# EAGLE design de0_expansion (EAGLE 6.4)
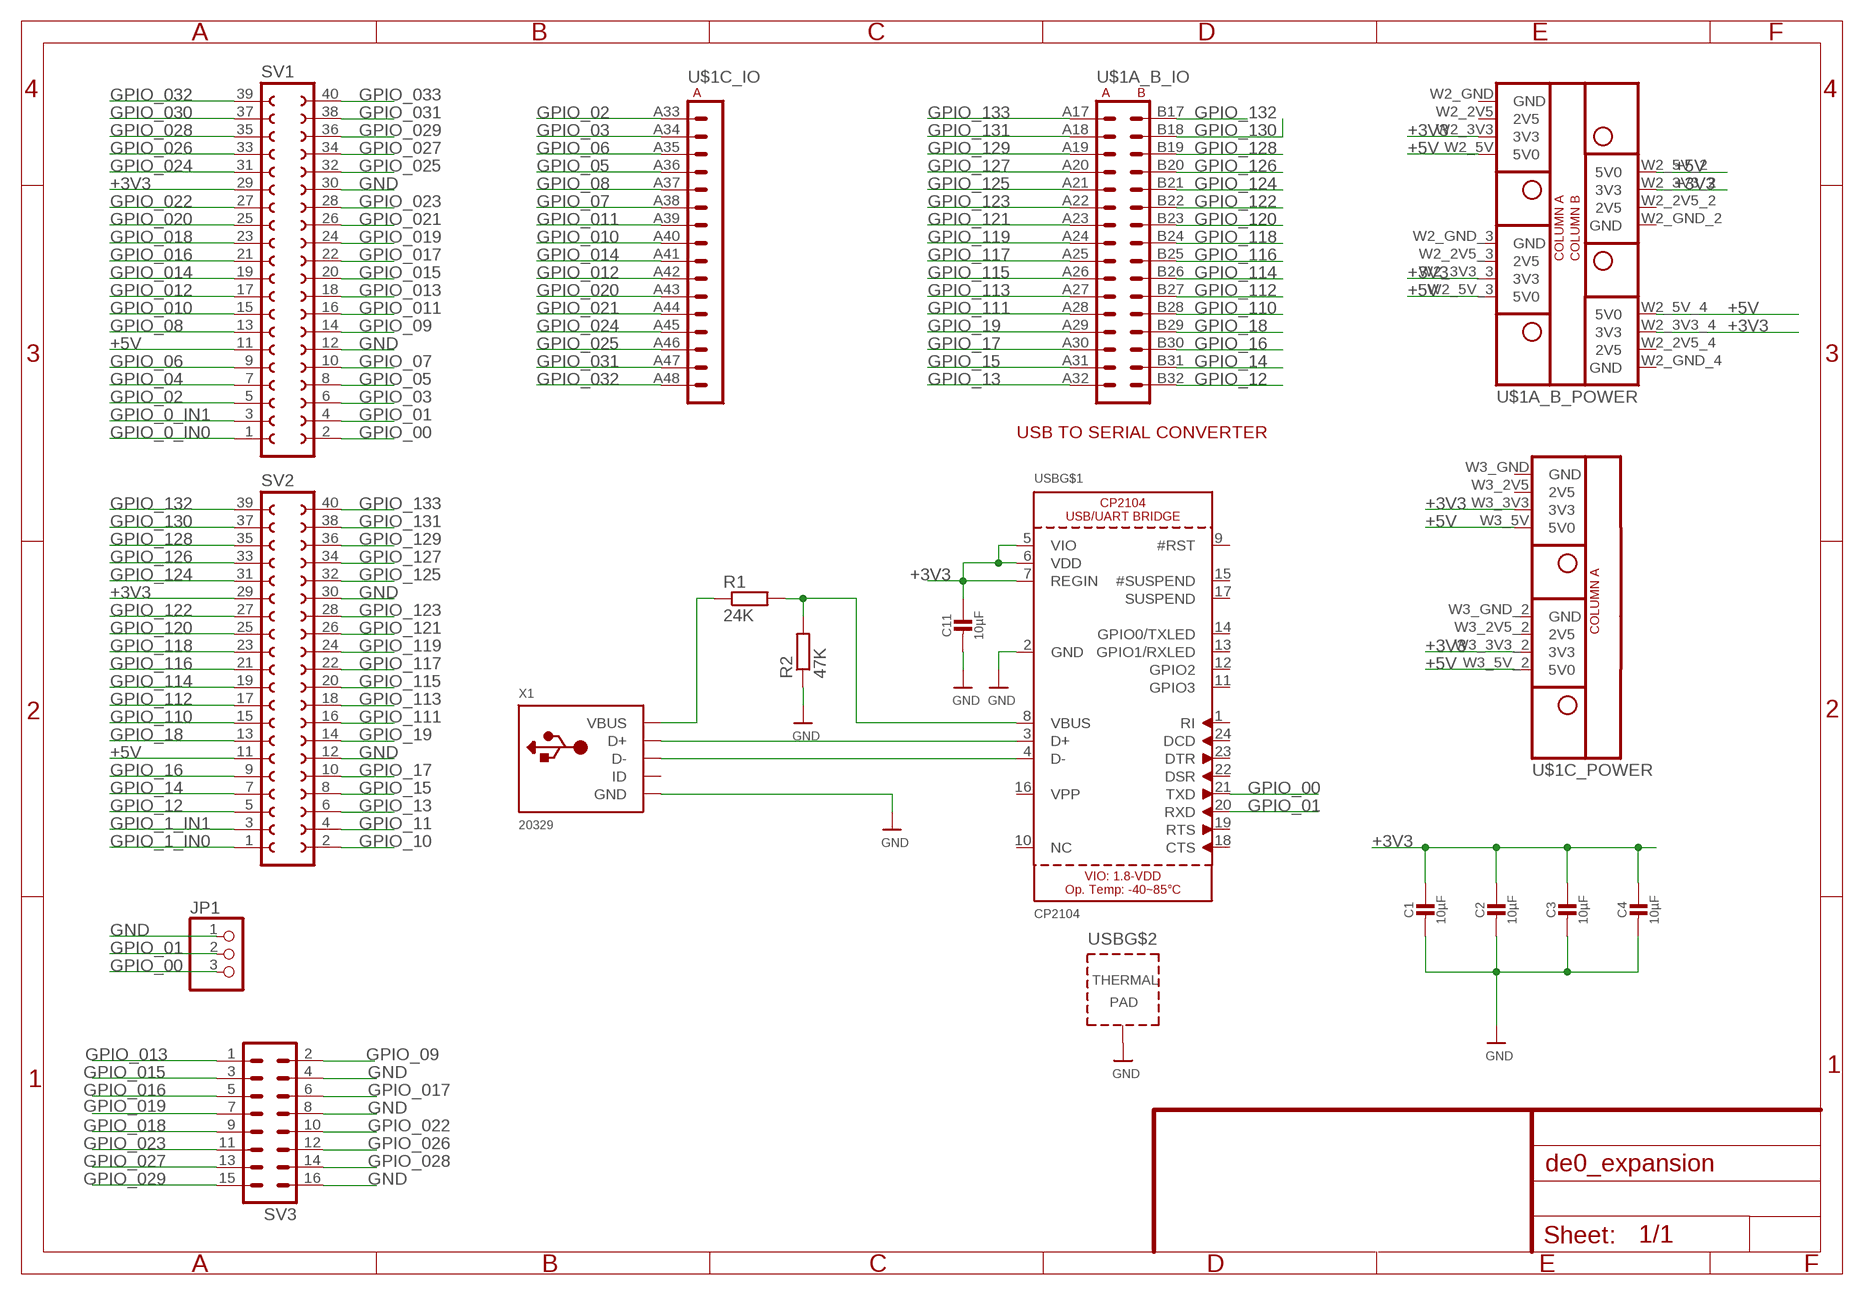
[diagram p0: schematic, sheet 1]

## Parts
C1  10µF  CAP_CERAMIC0805-NOOUTLINE  [0805-NO]
C2  10µF  CAP_CERAMIC0805-NOOUTLINE  [0805-NO]
C3  10µF  CAP_CERAMIC0805-NOOUTLINE  [0805-NO]
C4  10µF  CAP_CERAMIC0805-NOOUTLINE  [0805-NO]
C11  10µF  CAP_CERAMIC0805-NOOUTLINE  [0805-NO]
JP1  PINHD-1X3  [1X03]
R1  24K  R-EU_R0805W  [R0805W]
R2  47K  R-EU_R0805W  [R0805W]
SV1  FE20-2  [FE20-2]
SV2  FE20-2  [FE20-2]
SV3  ML16  [ML16]
U$1  MEGAWING_FULL_P1MEGAWING_P1  [MEGAWING_FULL_NOHOLES_P1]
USB  CP2104  [QFN24_4MM_SMSC]
X1  20329  USBMINIBLARGE  [USB-MINIB_LARGER]

## Nets
+3V3: C1.1 C2.1 C3.1 C4.1 C11.1 SV1.29 SV2.29 U$1.W2_3V3(A_B_POWER:3V3) U$1.W2_3V3_2(A_B_POWER:3V3) U$1.W2_3V3_3(A_B_POWER:3V3) U$1.W2_3V3_4(A_B_POWER:3V3) U$1.W3_3V3(C_POWER:3V3) U$1.W3_3V3_2(C_POWER:3V3) USB.5(VIO) USB.6(VDD) USB.7(REGIN)
+5V: SV1.11 SV2.11 U$1.W2_5V(A_B_POWER:5V0) U$1.W2_5V_2(A_B_POWER:5V0) U$1.W2_5V_3(A_B_POWER:5V0) U$1.W2_5V_4(A_B_POWER:5V0) U$1.W3_5V(C_POWER:5V0) U$1.W3_5V_2(C_POWER:5V0)
GND: C1.2 C2.2 C3.2 C4.2 C11.2 JP1.1 R2.1 SV1.12 SV1.30 SV2.12 SV2.30 SV3.4 SV3.8 SV3.16 USB.2(GND) USB.THERM(TP) X1.GND
GPIO_00: JP1.3 SV1.2 USB.21(TXD)
GPIO_0_IN0: SV1.1
GPIO_0_IN1: SV1.3
GPIO_01: JP1.2 SV1.4 USB.20(RXD)
GPIO_1_IN0: SV2.1
GPIO_1_IN1: SV2.3
GPIO_02: SV1.5 U$1.A33(C_IO:A1)
GPIO_03: SV1.6 U$1.A34(C_IO:A2)
GPIO_04: SV1.7
GPIO_05: SV1.8 U$1.A36(C_IO:A4)
GPIO_06: SV1.9 U$1.A35(C_IO:A3)
GPIO_07: SV1.10 U$1.A38(C_IO:A6)
GPIO_08: SV1.13 U$1.A37(C_IO:A5)
GPIO_09: SV1.14 SV3.2
GPIO_010: SV1.15 U$1.A40(C_IO:A8)
GPIO_10: SV2.2
GPIO_011: SV1.16 U$1.A39(C_IO:A7)
GPIO_11: SV2.4
GPIO_012: SV1.17 U$1.A42(C_IO:A10)
GPIO_12: SV2.5 U$1.B32(A_B_IO:B16)
GPIO_013: SV1.18 SV3.1
GPIO_13: SV2.6 U$1.A32(A_B_IO:A16)
GPIO_014: SV1.19 U$1.A41(C_IO:A9)
GPIO_14: SV2.7 U$1.B31(A_B_IO:B15)
GPIO_015: SV1.20 SV3.3
GPIO_15: SV2.8 U$1.A31(A_B_IO:A15)
GPIO_016: SV1.21 SV3.5
GPIO_16: SV2.9 U$1.B30(A_B_IO:B14)
GPIO_017: SV1.22 SV3.6
GPIO_17: SV2.10 U$1.A30(A_B_IO:A14)
GPIO_018: SV1.23 SV3.9
GPIO_18: SV2.13 U$1.B29(A_B_IO:B13)
GPIO_019: SV1.24 SV3.7
GPIO_19: SV2.14 U$1.A29(A_B_IO:A13)
GPIO_020: SV1.25 U$1.A43(C_IO:A11)
GPIO_021: SV1.26 U$1.A44(C_IO:A12)
GPIO_022: SV1.27 SV3.10
GPIO_023: SV1.28 SV3.11
GPIO_024: SV1.31 U$1.A45(C_IO:A13)
GPIO_025: SV1.32 U$1.A46(C_IO:A14)
GPIO_026: SV1.33 SV3.12
GPIO_027: SV1.34 SV3.13
GPIO_028: SV1.35 SV3.14
GPIO_029: SV1.36 SV3.15
GPIO_030: SV1.37
GPIO_031: SV1.38 U$1.A47(C_IO:A15)
GPIO_032: SV1.39 U$1.A48(C_IO:A16)
GPIO_033: SV1.40
GPIO_110: SV2.15 U$1.B28(A_B_IO:B12)
GPIO_111: SV2.16 U$1.A28(A_B_IO:A12)
GPIO_112: SV2.17 U$1.B27(A_B_IO:B11)
GPIO_113: SV2.18 U$1.A27(A_B_IO:A11)
GPIO_114: SV2.19 U$1.B26(A_B_IO:B10)
GPIO_115: SV2.20 U$1.A26(A_B_IO:A10)
GPIO_116: SV2.21 U$1.B25(A_B_IO:B9)
GPIO_117: SV2.22 U$1.A25(A_B_IO:A9)
GPIO_118: SV2.23 U$1.B24(A_B_IO:B8)
GPIO_119: SV2.24 U$1.A24(A_B_IO:A8)
GPIO_120: SV2.25 U$1.B23(A_B_IO:B7)
GPIO_121: SV2.26 U$1.A23(A_B_IO:A7)
GPIO_122: SV2.27 U$1.B22(A_B_IO:B6)
GPIO_123: SV2.28 U$1.A22(A_B_IO:A6)
GPIO_124: SV2.31 U$1.B21(A_B_IO:B5)
GPIO_125: SV2.32 U$1.A21(A_B_IO:A5)
GPIO_126: SV2.33 U$1.B20(A_B_IO:B4)
GPIO_127: SV2.34 U$1.A20(A_B_IO:A4)
GPIO_128: SV2.35 U$1.B19(A_B_IO:B3)
GPIO_129: SV2.36 U$1.A19(A_B_IO:A3)
GPIO_130: SV2.37 U$1.B18(A_B_IO:B2)
GPIO_131: SV2.38 U$1.A18(A_B_IO:A2)
GPIO_132: SV2.39 U$1.B17(A_B_IO:B1)
GPIO_133: SV2.40 U$1.A17(A_B_IO:A1)
N$1: R1.2 R2.2 USB.8(VBUS)
N$2: USB.3(D+) X1.D+
N$4: R1.1 X1.VBUS
N$6: USB.4(D-) X1.D-
Unconnected: U$1.W2_2V5(A_B_POWER:2V5) U$1.W2_2V5_2(A_B_POWER:2V5) U$1.W2_2V5_3(A_B_POWER:2V5) U$1.W2_2V5_4(A_B_POWER:2V5) U$1.W3_2V5(C_POWER:2V5) U$1.W3_2V5_2(C_POWER:2V5) USB.1(RI) USB.9(#RST) USB.10(NC) USB.11(GPIO3) USB.12(GPIO2) USB.13(GPIO1/RXLED) USB.14(GPIO0/TXLED) USB.15(#SUSPEND) USB.16(VPP) USB.17(SUSPEND) USB.18(CTS) USB.19(RTS) USB.22(DSR) USB.23(DTR) USB.24(DCD) X1.ID

## Notes on the sheet
- USB TO SERIAL CONVERTER

## Power pins joined to a net without a drawn wire
GND: U$1.W2_GND(A_B_POWER:GND) U$1.W2_GND_2(A_B_POWER:GND) U$1.W2_GND_3(A_B_POWER:GND) U$1.W2_GND_4(A_B_POWER:GND) U$1.W3_GND(C_POWER:GND) U$1.W3_GND_2(C_POWER:GND)

## Library data of the parts
C1-C4 C11 = microbuilder:CAP_CERAMIC: Ceramic Capacitors For new designs, use the packages preceded by an '_' character since they are more reliable: The following footprints should be used on most boards: _0402 - Standard footprint for regular board layouts _0603 - Standard footprint for regular board layouts _0805 - Standard footprint for regular board layouts _1206 - Standard footprint for regular board layouts For extremely tight-pitch boards where space is at a premium, the following 'micro-pitch' footprints can be used (smaller pads, no silkscreen outline, etc.): _0402MP - Micro-pitch footprint for very dense/compact boards _0603MP - Micro-pitch footprint for very dense/compact boards _0805MP - Micro-pitch footprint for very dense/compact boards _1206MP - Micro-pitch footprint for very dense/compact boards; PARTNO: CL21F106ZPFNNNE,Samsung,DK,1276-3012-1-ND,CAP CER 10UF 10V Y5V 0805, REF1
JP1 = pinhead:PINHD-1X3: PIN HEADER
R1 R2 = rcl:R-EU_: RESISTOR, European symbol
SV1 SV2 = con-lsta:FE20-2: FEMALE HEADER; OC_FARNELL: unknown; OC_NEWARK: unknown
SV3 = con-ml:ML16: HARTING; PARTNO: PRPC004DAAN-RC
U$1 = Papilio:MEGAWING_FULL_P1
USB = microbuilder:CP2104: CP2104 - USB to UART Bridge VDD Output: 3.45V; PARTNO: CP2104-F03-GM,Silicon Labs,dk,336-2008-5-ND ,IC SGL USB-TO-UART BRIDGE 24QFN, REF106
X1 = microbuilder:USB: USB Connectors USBMINIB - Surface Mount Female Mini-B USB Connector 4UConnector: 06564; PARTNO: 10118193-0001LF,Amphenol,dk,609-4616-1-ND ,USB micro B USB 2.0 Receptacle Connector 5 Position Surface Mount Right Angle Horizontal , REF86

## Board
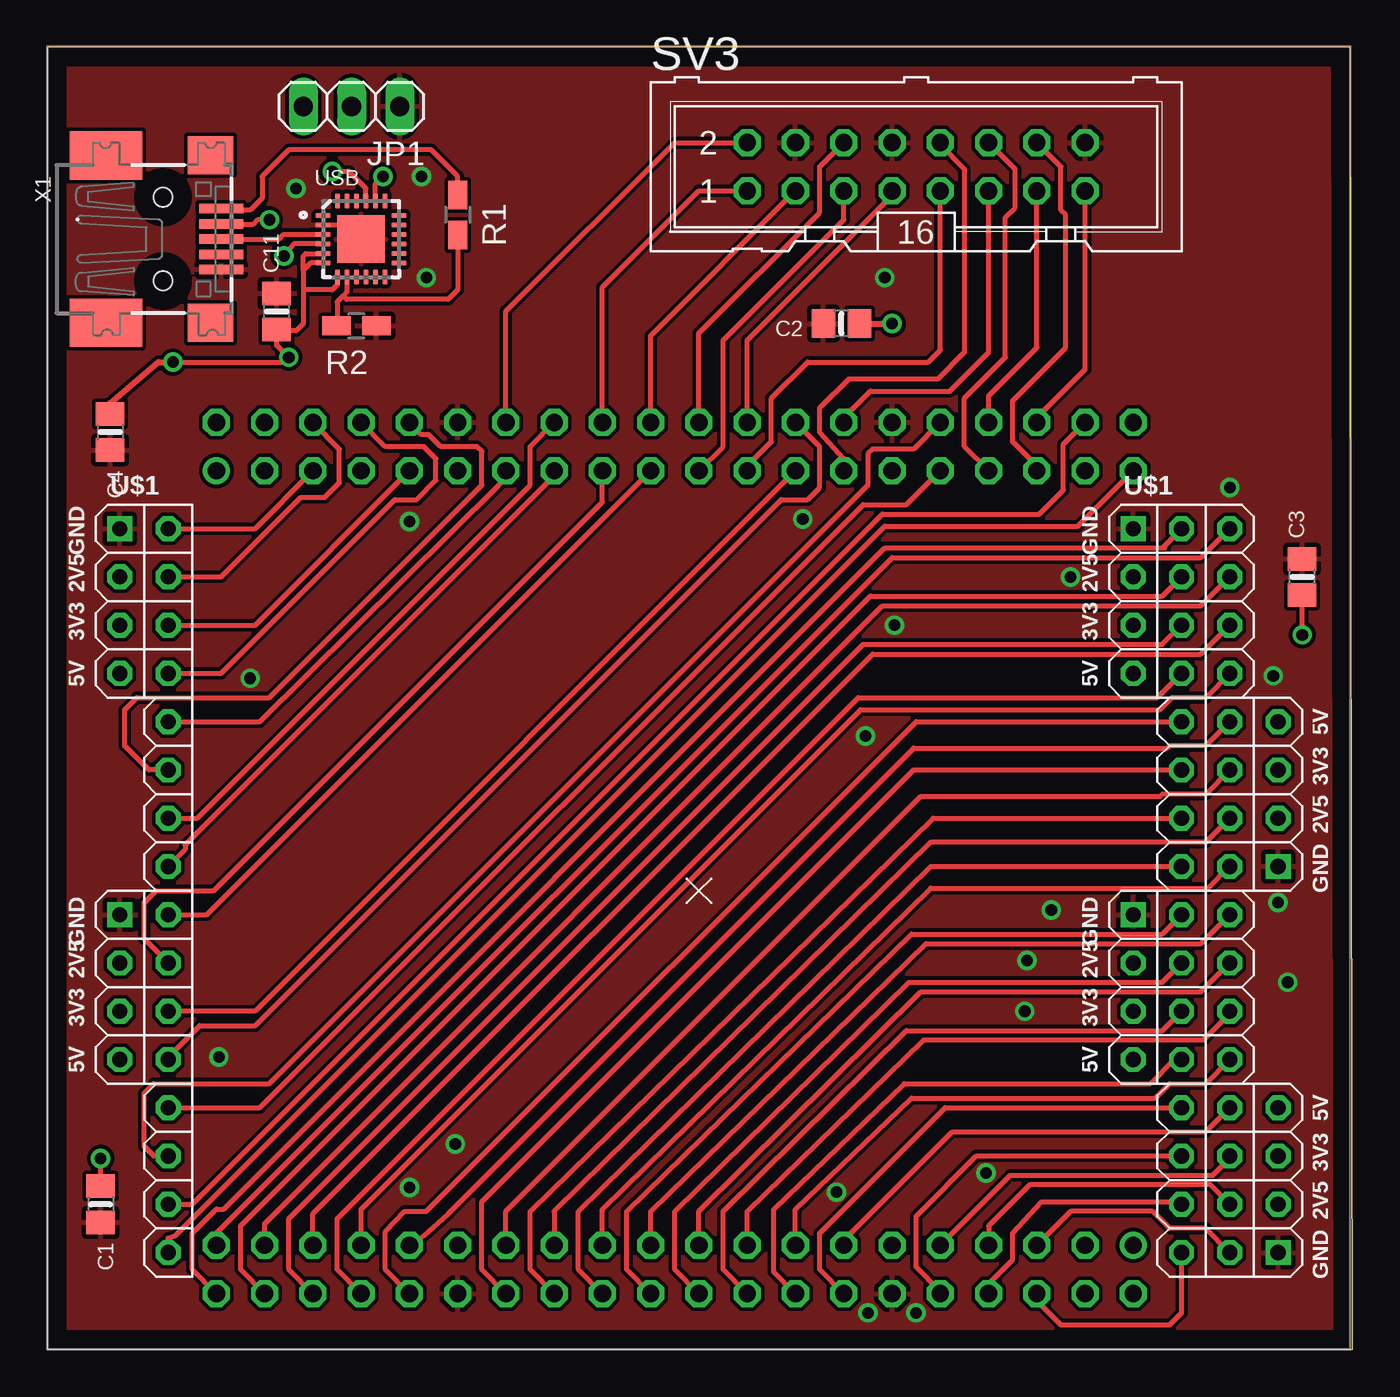
[diagram p1: board, top side]
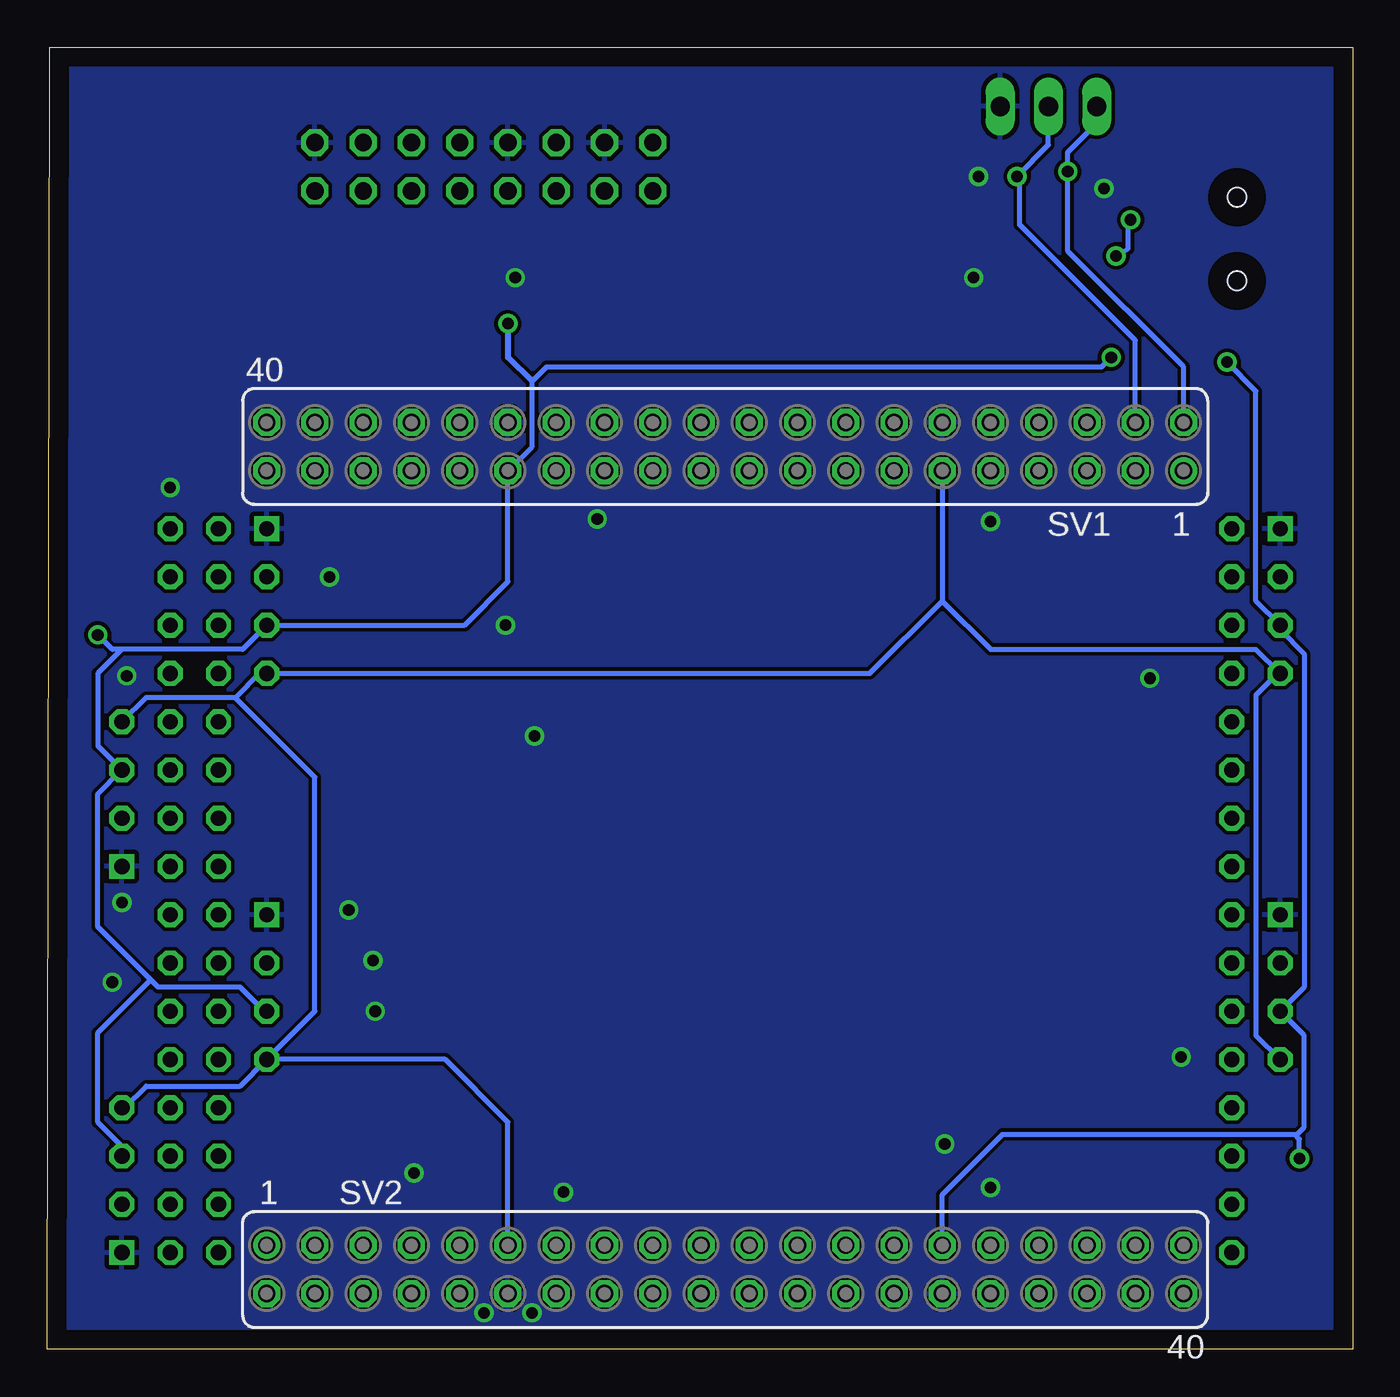
[diagram p2: board, bottom side, seen from below]

Size 68.69 x 68.5 mm. Coordinates in mm from the lower left corner, seen from the top.
Outline: 0,0 68.69,0 68.56,68.5 0,68.5 0,0
Copper layers (1*16): Top 0.035mm / dielectric 1.5mm / Bottom 0.035mm
Design rules "default": minimum track width 10mil, minimum drill 24mil, track to track 8mil, track to pad 8mil, pad to pad 8mil, via to via 8mil, smd to smd 8mil, copper to edge 40mil, drill to drill 8mil, minimum pad ring 10mil, minimum via ring 8mil, stop-mask expansion 4mil, vias tented up to drill 0mil, thermal gap 10mil

### Footprints (pad centres in the part's own frame; a part is rotated, then mirrored left to right if it is on the bottom)
0805-NO = smd 1.24 x 1.5: 1 -0.95,0; 2 0.95,0
1X03 = drill 1.016 long: 1 -2.54,0; 2 0,0; 3 2.54,0
R0805W = smd 1.5 x 1: 1 -1.052,0; 2 1.052,0
FE20-2 = drill 0.914: 1 -24.13,1.27 | drill 0.914 octagon: 2 -24.13,-1.27; 3 -21.59,1.27; 4 -21.59,-1.27; 5 -19.05,1.27; 6 -19.05,-1.27; 7 -16.51,1.27; 8 -16.51,-1.27; 9 -13.97,1.27; 10 -13.97,-1.27; 11 -11.43,1.27; 12 -11.43,-1.27; 13 -8.89,1.27; 14 -8.89,-1.27; 15 -6.35,1.27; 16 -6.35,-1.27; 17 -3.81,1.27; 18 -3.81,-1.27; 19 -1.27,1.27; 20 -1.27,-1.27; 21 1.27,1.27; 22 1.27,-1.27; 23 3.81,1.27; 24 3.81,-1.27; 25 6.35,1.27; 26 6.35,-1.27; 27 8.89,1.27; 28 8.89,-1.27; 29 11.43,1.27; 30 11.43,-1.27; 31 13.97,1.27; 32 13.97,-1.27; 33 16.51,1.27; 34 16.51,-1.27; 35 19.05,1.27; 36 19.05,-1.27; 37 21.59,1.27; 38 21.59,-1.27; 39 24.13,1.27; 40 24.13,-1.27
ML16 = drill 0.914 octagon: 1 -8.89,-1.27; 2 -8.89,1.27; 3 -6.35,-1.27; 4 -6.35,1.27; 5 -3.81,-1.27; 6 -3.81,1.27; 7 -1.27,-1.27; 8 -1.27,1.27; 9 1.27,-1.27; 10 1.27,1.27; 11 3.81,-1.27; 12 3.81,1.27; 13 6.35,-1.27; 14 6.35,1.27; 15 8.89,-1.27; 16 8.89,1.27
MEGAWING_FULL_NOHOLES_P1 = drill 0.8 octagon: A17 59.69,43.18; A18 59.69,40.64; A19 59.69,38.1; A20 59.69,35.56; A21 59.69,33.02; A22 59.69,30.48; A23 59.69,27.94; A24 59.69,25.4; A25 59.69,22.86; A26 59.69,20.32; A27 59.69,17.78; A28 59.69,15.24; A29 59.69,12.7; A30 59.69,10.16; A31 59.69,7.62; A32 59.69,5.08; A33 6.35,43.18; A34 6.35,40.64; A35 6.35,38.1; A36 6.35,35.56; A37 6.35,33.02; A38 6.35,30.48; A39 6.35,27.94; A40 6.35,25.4; A41 6.35,22.86; A42 6.35,20.32; A43 6.35,17.78; A44 6.35,15.24; A45 6.35,12.7; A46 6.35,10.16; A47 6.35,7.62; A48 6.35,5.08; B17 62.23,43.18; B18 62.23,40.64; B19 62.23,38.1; B20 62.23,35.56; B21 62.23,33.02; B22 62.23,30.48; B23 62.23,27.94; B24 62.23,25.4; B25 62.23,22.86; B26 62.23,20.32; B27 62.23,17.78; B28 62.23,15.24; B29 62.23,12.7; B30 62.23,10.16; B31 62.23,7.62; B32 62.23,5.08; W2_2V5 57.15,40.64; W2_2V5_2 64.77,27.94; W2_2V5_3 57.15,20.32; W2_2V5_4 64.77,7.62; W2_3V3 57.15,38.1; W2_3V3_2 64.77,30.48; W2_3V3_3 57.15,17.78; W2_3V3_4 64.77,10.16; W2_5V 57.15,35.56; W2_5V_2 64.77,33.02; W2_5V_3 57.15,15.24; W2_5V_4 64.77,12.7; W3_2V5 3.81,40.64; W3_2V5_2 3.81,20.32; W3_3V3 3.81,38.1; W3_3V3_2 3.81,17.78; W3_5V 3.81,35.56; W3_5V_2 3.81,15.24 | drill 0.8 square: W2_GND 57.15,43.18; W2_GND_2 64.77,25.4; W2_GND_3 57.15,22.86; W2_GND_4 64.77,5.08; W3_GND 3.81,43.18; W3_GND_2 3.81,22.86
QFN24_4MM_SMSC = smd 0.8 x 0.28: 1 -2,1.25; 2 -2,0.75; 3 -2,0.25; 4 -2,-0.25; 5 -2,-0.75; 6 -2,-1.25; 13 2,-1.25; 14 2,-0.75; 15 2,-0.25; 16 2,0.25; 17 2,0.75; 18 2,1.25 | smd 0.28 x 0.8: 7 -1.25,-2; 8 -0.75,-2; 9 -0.25,-2; 10 0.25,-2; 11 0.75,-2; 12 1.25,-2; 19 1.25,2; 20 0.75,2; 21 0.25,2; 22 -0.25,2; 23 -0.75,2; 24 -1.25,2 | smd 2.5 x 2.5: THERM 0,0
USB-MINIB_LARGER = smd 0.5 x 2.308: D+ 0,4.064; D- -0.8,4.064; GND 1.6,4.064; ID 0.8,4.064; VBUS -1.6,4.064 | smd 2.54 x 3.81: GND1 -4.4,-2; GND4 4.4,-2 | smd 2 x 2.4: GND2 -4.4,3.5; GND3 4.4,3.5 | hole 1: -2.2,1; 2.2,1

### Placement (x,y rotation side)
C1  2.79,7.62 270 top
C2  41.78,53.98 180 top
C3  66.04,40.64 90 top
C4  3.3,48.26 270 top
C11  12.06,54.61 90 top
JP1  16,65.41 180 top
R1  21.59,59.69 270 top
R2  16.26,53.85 180 top
SV1  33.02,47.5 180 bottom
SV2  33.02,4.19 0 bottom
SV3  45.72,62.23 0 top
U$1  0,0 0 top
USB  16.51,58.42 0 top
X1  5.08,58.42 270 top

### Tracks (layer width: path | path; a pad name or v marks a point on that pad's centre or on a via)
+3V3  (via drill 0.61)
  Top 0.254: USB.6 13.86,57.17 13.46,56.77 | 13.46,56.77 13.46,57.53 13.59,57.66 14.5,57.66 USB.5 | 13.46,56.77 13.46,55.75 | 13.46,55.75 13.46,53.98 13.08,53.59 12.13,53.59 C11.1 12.06,52.83 v12.7,52.2 12.45,51.94 v6.6,51.94 | USB.7 15.26,56.03 14.99,55.75 13.46,55.75 | v66.04,37.59 C3.1 | C1.1 v2.79,10.03
  Top 0.305: C4.1 3.3,49.78 5.84,51.94 v6.6,51.94 | C2.1 v44.45,53.98
  Bottom 0.254: v12.7,52.2 13.21,51.69 42.42,51.69 43.18,50.93 43.18,47.5 SV1.29 44.45,40.39 46.74,38.1 U$1.W2_3V3 58.42,36.83 64.77,36.83 | v6.6,51.94 5.08,50.42 5.08,39.37 U$1.W3_3V3 3.81,37.85 2.54,36.58 2.54,19.05 U$1.W3_3V3_2 2.54,16.51 2.54,11.68 2.92,11.3 3.05,11.3 | SV2.29 21.59,8.13 18.41,11.3 3.05,11.3 | U$1.W2_3V3_3 57.28,17.78 58.55,19.05 62.87,19.05 63.25,19.43 | 63.25,19.43 66.04,22.23 66.04,29.21 U$1.W2_3V3_2 66.04,31.75 66.04,35.56 64.77,36.83 | U$1.W2_3V3_4 64.77,10.67 66.04,11.94 66.04,16.64 63.25,19.43 | 64.77,36.83 65.28,36.83 v66.04,37.59 | v2.79,10.03 2.79,11.05 3.05,11.3
  Bottom 0.305: v44.45,53.98 44.45,52.2 43.18,50.93
+5V
  Bottom 0.254: SV1.11 21.59,39.37 | 21.59,39.37 19.05,36.83 5.08,36.83 U$1.W3_5V 3.94,35.56 5.08,34.42 5.08,16.51 U$1.W3_5V_2 | 21.59,39.37 25.4,35.56 U$1.W2_5V 57.53,35.56 58.8,34.29 | 58.8,34.29 63.5,34.29 U$1.W2_5V_2 | SV2.11 44.45,11.94 47.75,15.24 U$1.W2_5V_3 | U$1.W2_5V_3 54.61,17.78 54.61,30.1 58.8,34.29 | U$1.W2_5V_4 64.64,12.7 63.5,13.84 58.55,13.84 U$1.W2_5V_3
GND  (via drill 0.61)
  Top 0.254: USB.2 15.76,59.17 USB.THERM
  other vias: 13.08,61.09 19.68,61.72 19.94,56.39 64.77,23.5 65.28,19.3 49.4,9.27 41.53,8.26 64.52,35.43 19.05,43.56 10.67,35.31 39.75,43.69 53.85,40.64 44.58,38.1 9.02,15.37 43.05,32.26 19.05,8.51 21.46,10.79 52.83,23.11 62.23,45.34 51.56,20.45 51.44,17.78 45.72,1.91 43.18,1.91 44.07,56.39
  pour Top: 0,68.58 68.58,68.58 68.58,0 0,0
  pour Bottom: 0,68.45 68.58,68.58 68.58,0 0,0
GPIO_00  (via drill 0.61)
  Top 0.254: USB.21 16.76,61.09 15.88,61.98 v14.99,61.98
  Bottom 0.254: JP1.3 13.46,64.52 14.99,62.99 v14.99,61.98 14.99,57.78 8.89,51.69 SV1.2
GPIO_01  (via drill 0.61)
  Top 0.254: USB.20 17.26,61.33 v17.65,61.72
  Bottom 0.254: JP1.2 15.88,66.67 15.88,65.91 16,65.79 16,63.37 v17.65,61.72 17.53,61.59 17.53,59.18 11.43,53.09 SV1.4
GPIO_02
  Top 0.254: U$1.A33 10.92,43.18 SV1.5
GPIO_03
  Top 0.254: U$1.A34 9.14,40.64 13.34,44.83 14.61,44.83 15.37,45.59 15.37,47.37 SV1.6
GPIO_05
  Top 0.254: U$1.A36 9.14,35.56 18.29,44.7 19.43,44.7 20.45,45.72 20.45,46.86 19.81,47.5 17.78,47.5 SV1.8
GPIO_06
  Top 0.254: U$1.A35 10.92,38.1 SV1.9
GPIO_07
  Top 0.254: U$1.A38 5.33,30.48 4.06,31.75 4.06,33.66 4.7,34.29 11.68,34.29 22.86,45.47 22.86,47.24 22.61,47.5 20.7,47.5 20.07,48.13 19.68,48.13 SV1.10
GPIO_08
  Top 0.254: U$1.A37 11.18,33.02 23.75,45.47 24.13,45.85 SV1.13
GPIO_09
  Top 0.254: SV1.14 24.13,54.61 33.02,63.5 SV3.2
GPIO_010
  Top 0.254: SV1.15 26.67,45.97 7.24,26.54 7.24,26.29 U$1.A40
GPIO_011
  Top 0.254: U$1.A39 7.87,27.94 25.4,45.47 25.4,47.5 SV1.16
GPIO_012
  Top 0.254: U$1.A42 5.08,21.59 5.08,23.5 5.71,24.13 8.76,24.13 29.21,44.58 SV1.17
GPIO_12
  Top 0.254: U$1.B32 60.96,6.35 59.05,6.35 58.17,7.24 53.85,7.24 SV2.5
GPIO_013
  Top 0.254: SV1.18 29.21,55.88 34.29,60.96 SV3.1
GPIO_13
  Top 0.254: SV2.6 52.07,2.54 53.34,1.27 59.05,1.27 59.69,1.91 U$1.A32
GPIO_014
  Top 0.254: U$1.A41 8.38,22.86 SV1.19
GPIO_14
  Top 0.254: U$1.B31 61.21,8.64 51.69,8.64 49.53,6.48 SV2.7
GPIO_015
  Top 0.254: SV1.20 31.75,53.34 SV3.3
GPIO_15
  Top 0.254: SV2.8 49.53,3.43 50.8,4.7 50.8,6.1 52.32,7.75 59.56,7.75 U$1.A31
GPIO_016
  Top 0.254: SV1.21 35.56,47.5 35.56,53.09 41.91,59.44 SV3.5
GPIO_16
  Top 0.254: U$1.B30 62.23,10.03 61.34,9.14 50.67,9.14 SV2.9
GPIO_017
  Top 0.254: SV1.22 34.29,53.47 40.64,59.82 40.64,62.23 SV3.6
GPIO_17
  Top 0.254: SV2.10 46.99,3.05 45.72,4.32 45.72,6.99 48.9,10.16 U$1.A30
GPIO_018
  Top 0.254: SV1.23 36.83,46.48 38.1,47.75 38.1,50.04 40.01,51.94 46.35,51.94 46.99,52.58 SV3.9
GPIO_18
  Top 0.254: U$1.B29 60.96,11.43 47.62,11.43 41.91,5.71 SV2.13
GPIO_019
  Top 0.254: SV1.24 36.83,53.09 44.07,60.33 44.07,60.58 SV3.7
GPIO_19
  Top 0.254: SV2.14 40.64,4.19 40.64,6.1 47.24,12.7 U$1.A29
GPIO_020
  Top 0.254: SV1.25 10.92,17.78 U$1.A43
GPIO_021
  Top 0.254: U$1.A44 6.35,15.37 8,17.02 10.92,17.02 38.61,44.7 40.01,44.7 40.64,45.34 40.64,47.5 SV1.26
GPIO_022
  Top 0.254: SV1.27 41.91,46.86 40.64,48.26 40.64,49.53 42.16,51.05 46.86,51.05 48.26,52.45 48.26,62.1 46.99,63.37 SV3.10
GPIO_023
  Top 0.254: SV1.28 41.91,49.02 43.31,50.42 47.5,50.42 49.53,52.45 SV3.11
GPIO_024
  Top 0.254: U$1.A45 11.18,12.7 42.93,44.45 45.21,44.45 SV1.31
GPIO_025
  Top 0.254: SV1.32 45.59,47.37 43.43,47.37 43.18,47.12 43.18,45.47 11.68,13.97 5.59,13.97 5.08,13.46 5.08,10.67 5.59,10.16 U$1.A46
GPIO_026
  Top 0.254: SV1.33 48.26,47.5 48.26,50.04 50.42,52.2 50.42,59.56 50.93,60.07 50.93,62.1 SV3.12
GPIO_027
  Top 0.254: SV1.34 49.53,50.16 52.07,52.7 SV3.13
GPIO_028
  Top 0.254: SV1.35 52.07,46.48 50.8,47.75 50.8,49.91 53.59,52.7 53.59,59.69 53.34,59.94 53.34,62.23 SV3.14
GPIO_029
  Top 0.254: SV1.36 52.07,49.02 54.61,51.56 SV3.15
GPIO_031
  Top 0.254: U$1.A47 7.62,7.62 43.94,43.94 52.2,43.94 53.47,45.21 53.47,47.62 SV1.38
GPIO_032
  Top 0.254: U$1.A48 6.35,5.84 6.73,5.97 44.07,43.31 54.23,43.31 SV1.39
GPIO_110
  Top 0.254: U$1.B28 60.96,13.97 59.05,13.97 58.29,13.21 45.47,13.21 39.37,7.37 SV2.15
GPIO_111
  Top 0.254: U$1.A28 59.31,15.24 58.04,13.97 45.09,13.97 38.23,7.37 38.23,4.06 SV2.16
GPIO_112
  Top 0.254: SV2.17 36.83,7.24 46.1,16.26 60.83,16.26 62.23,17.65 U$1.B27
GPIO_113
  Top 0.254: 36.83,2.54 SV2.18 35.56,4.19 35.56,7.24 45.21,16.76 58.67,16.76 U$1.A27
GPIO_114
  Top 0.254: U$1.B26 60.71,18.8 45.97,18.8 34.29,7.24 SV2.19
GPIO_115
  Top 0.254: U$1.A26 58.67,19.3 45.34,19.3 33.02,7.24 33.02,4.19 SV2.20
GPIO_116
  Top 0.254: U$1.B25 60.71,21.34 46.23,21.34 31.75,7.24 SV2.21
GPIO_117
  Top 0.254: U$1.A25 58.67,21.84 45.47,21.84 30.48,7.24 30.48,4.19 SV2.22
GPIO_118
  Top 0.254: SV2.23 29.21,7.37 46.48,24.26 61.09,24.26 U$1.B24
GPIO_119
  Top 0.254: SV2.24 27.94,4.19 27.94,7.24 46.48,25.4 U$1.A24
GPIO_120
  Top 0.254: U$1.B23 60.96,26.67 46.48,26.67 26.67,7.24 SV2.25
GPIO_121
  Top 0.254: SV2.26 25.4,4.19 25.4,7.24 46.61,27.94 U$1.A23
GPIO_122
  Top 0.254: SV2.27 24.13,7.24 45.97,29.08 58.55,29.08 58.67,29.21 60.96,29.21 U$1.B22
GPIO_123
  Top 0.254: SV2.28 22.86,4.19 22.86,7.75 45.59,30.48 U$1.A22
GPIO_124
  Top 0.254: U$1.B21 60.96,31.75 59.05,31.75 58.93,31.62 45.59,31.62 21.08,7.11 19.81,5.97 SV2.31
GPIO_125
  Top 0.254: SV2.32 17.78,4.19 17.78,6.17 18.8,7.24 19.94,7.24 45.72,33.02 U$1.A21
GPIO_126
  Top 0.254: U$1.B20 60.96,34.29 59.18,34.29 58.55,33.66 42.8,33.66 16.51,7.37 SV2.33
GPIO_127
  Top 0.254: U$1.A20 58.42,34.29 42.67,34.29 15.24,6.86 15.24,4.19 SV2.34
GPIO_128
  Top 0.254: U$1.B19 60.71,36.58 43.43,36.58 13.97,7.11 SV2.35
GPIO_129
  Top 0.254: U$1.A19 58.67,37.08 42.93,37.08 12.7,6.86 12.7,4.19 SV2.36
GPIO_130
  Top 0.254: U$1.B18 60.71,39.12 43.94,39.12 11.43,6.6 SV2.37
GPIO_131
  Top 0.254: U$1.A18 58.67,39.62 43.31,39.62 10.16,6.48 10.16,4.19 SV2.38
GPIO_132
  Top 0.254: U$1.B17 60.71,41.66 44.45,41.66 8.89,6.1 SV2.39
GPIO_133
  Top 0.254: U$1.A17 58.8,42.29 58.8,42.16 44.07,42.16 9.27,7.37 8.89,7.37 7.62,6.1 7.62,4.19 SV2.40
N$1
  Top 0.254: USB.8 15.76,55.64 15.56,55.44 | 15.56,55.44 15.24,55.12 15.24,53.88 R2.2 | R1.2 21.59,55.75 21.08,55.24 15.75,55.24 15.56,55.44
N$2
  Top 0.254: X1.D+ 12.19,58.42 12.45,58.67 USB.3
N$4
  Top 0.254: R1.1 21.59,61.72 20.19,63.12 12.7,63.12 11.3,61.72 11.3,60.58 10.67,59.94 9.22,59.94 X1.VBUS
N$6  (via drill 0.61)
  Top 0.254: USB.4 12.96,58.17 v12.45,57.53 | v11.68,59.44 11.05,59.44 10.79,59.18 9.18,59.18 X1.D-
  Bottom 0.254: v12.45,57.53 11.81,57.91 11.81,59.31 v11.68,59.44

### Text on the board
201bmp: /home/alvieboy/zpuino32-800x600.bmp